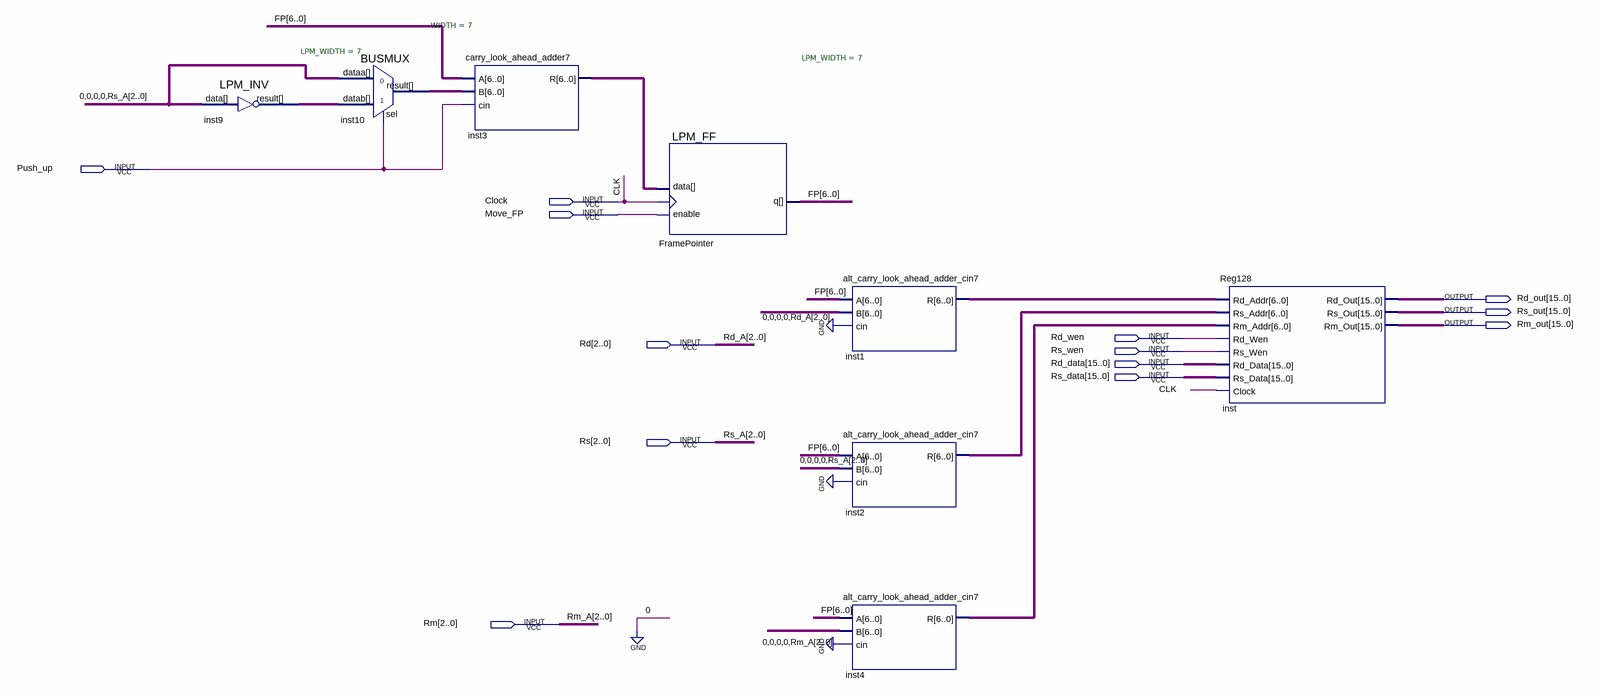
[diagram p0: schematic sheet]
// Quartus schematic RegisterStack.bdf as structural Verilog: 8 symbols, 13 pins
module RegisterStack (
  input  Push_up,
  input  Clock,
  input  Move_FP,
  input  Rd_wen,
  input  [2:0] Rd,
  input  Rs_wen,
  input  [15:0] Rd_data,
  input  [15:0] Rs_data,
  input  [2:0] Rs,
  input  [2:0] Rm,
  output [15:0] Rd_out,
  output [15:0] Rs_out,
  output [15:0] Rm_out
);

  wire [6:0] FP, inst1_r, inst2_r, inst3_r, inst4_r, inst9_result, inst10_result;

  LPM_INV #(.LPM_WIDTH(7)) inst9 (.data({4'b0000, Rs}), .result(inst9_result));
  BUSMUX #(.WIDTH(7)) inst10 (.datab(inst9_result), .sel(Push_up), .dataa({4'b0000, Rs}), .result(inst10_result));
  carry_look_ahead_adder7 inst3 (.A(FP), .B(inst10_result), .cin(Push_up), .R(inst3_r));
  LPM_FF #(.LPM_WIDTH(7)) FramePointer (.enable(Move_FP), .clock(Clock), .data(inst3_r), .q(FP));
  alt_carry_look_ahead_adder_cin7 inst1 (.A(FP), .B({4'b0000, Rd}), .cin(1'b0), .R(inst1_r));
  alt_carry_look_ahead_adder_cin7 inst2 (.A(FP), .B({4'b0000, Rs}), .cin(1'b0), .R(inst2_r));
  alt_carry_look_ahead_adder_cin7 inst4 (.A(FP), .B({4'b0000, Rm}), .cin(1'b0), .R(inst4_r));
  Reg128 inst (
    .Rd_Addr(inst1_r), .Rs_Addr(inst2_r), .Rm_Addr(inst4_r), .Rd_Wen(Rd_wen), .Rs_Wen(Rs_wen),
    .Rd_Data(Rd_data), .Rs_Data(Rs_data), .Clock(Clock), .Rd_Out(Rd_out), .Rs_Out(Rs_out), .Rm_Out(Rm_out));

  // Other names for the same wires on the sheet: CLK = Clock; Rd_A[2:0] = Rd; Rm_A[2:0] = Rm; Rs_A[2:0] = Rs
endmodule
